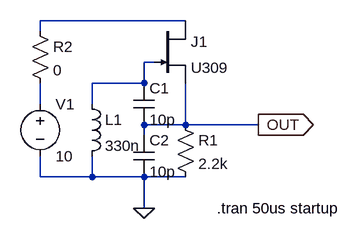
[diagram p0: schematic colpitts_jfet.asc]
colpitts_jfet.asc, the LTspice schematic file:
Version 4
SHEET 1 880 680
WIRE 272 0 48 0
WIRE 48 16 48 0
WIRE 224 64 208 64
WIRE 208 96 208 64
WIRE 208 96 128 96
WIRE 208 112 208 96
WIRE 48 128 48 96
WIRE 128 128 128 96
WIRE 272 160 272 96
WIRE 272 160 208 160
WIRE 384 160 272 160
WIRE 208 176 208 160
WIRE 48 240 48 208
WIRE 128 240 128 208
WIRE 128 240 48 240
WIRE 208 240 208 224
WIRE 208 240 128 240
WIRE 272 240 208 240
WIRE 208 288 208 240
FLAG 208 288 0
FLAG 384 160 OUT
IOPIN 384 160 Out
SYMBOL ind 112 112 R0
SYMATTR InstName L1
SYMATTR Value 330n
SYMBOL cap 192 96 R0
SYMATTR InstName C1
SYMATTR Value 10p
SYMBOL cap 192 176 R0
SYMATTR InstName C2
SYMATTR Value 10p
SYMBOL res 256 144 R0
SYMATTR InstName R1
SYMATTR Value 2.2k
SYMBOL njf 224 0 R0
SYMATTR InstName J1
SYMATTR Value U309
SYMBOL voltage 48 112 R0
WINDOW 123 0 0 Left 2
WINDOW 39 0 0 Left 2
SYMATTR InstName V1
SYMATTR Value 10
SYMBOL res 32 0 R0
SYMATTR InstName R2
SYMATTR Value 0
TEXT 320 288 Left 2 !.tran 50us startup

The netlist it stands for:
* colpitts_jfet.asc
L1 N002 0 330n
C1 N002 OUT 10p
C2 OUT 0 10p
R1 OUT 0 2.2k
J1 N001 N002 OUT U309
V1 N003 0 10
R2 N001 N003 0
.model NJF NJF
.model PJF PJF
.lib standard.jft
.tran 50us startup
.backanno
.end